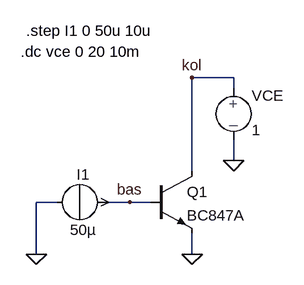
[diagram p0: schematic Q2.asc]
Q2.asc, the LTspice schematic file:
Version 4
SHEET 1 880 680
WIRE 288 -16 224 -16
WIRE 288 0 288 -16
WIRE 288 112 288 80
WIRE 224 128 224 -16
WIRE 16 176 -16 176
WIRE 128 176 96 176
WIRE 160 176 128 176
WIRE -16 256 -16 176
WIRE 224 256 224 224
FLAG 224 256 0
FLAG 224 -16 kol
FLAG 128 176 bas
FLAG 288 112 0
FLAG -16 256 0
SYMBOL EIT_Semiconductors\\npn 160 128 R0
SYMATTR InstName Q1
SYMATTR Value BC847A
SYMBOL source-V 288 -16 R0
SYMATTR InstName VCE
SYMATTR Value 1
SYMBOL source-I 96 176 R90
WINDOW 0 -27 40 VBottom 2
WINDOW 3 27 40 VTop 2
SYMATTR InstName I1
SYMATTR Value 50µ
TEXT -40 -56 Left 2 !.dc vce 0 20 10m 
TEXT -32 -88 Left 2 !.step I1 0 50u 10u

The netlist it stands for:
* Q2.asc
Q1 kol bas 0 0 BC847A
VCE kol 0 1
I1 0 bas 50µ
.model NPN NPN
.model PNP PNP
.lib standard.bjt
.dc vce 0 20 10m
.step I1 0 50u 10u
.backanno
.end